# EAGLE design ai_candle (EAGLE 7.1.0)
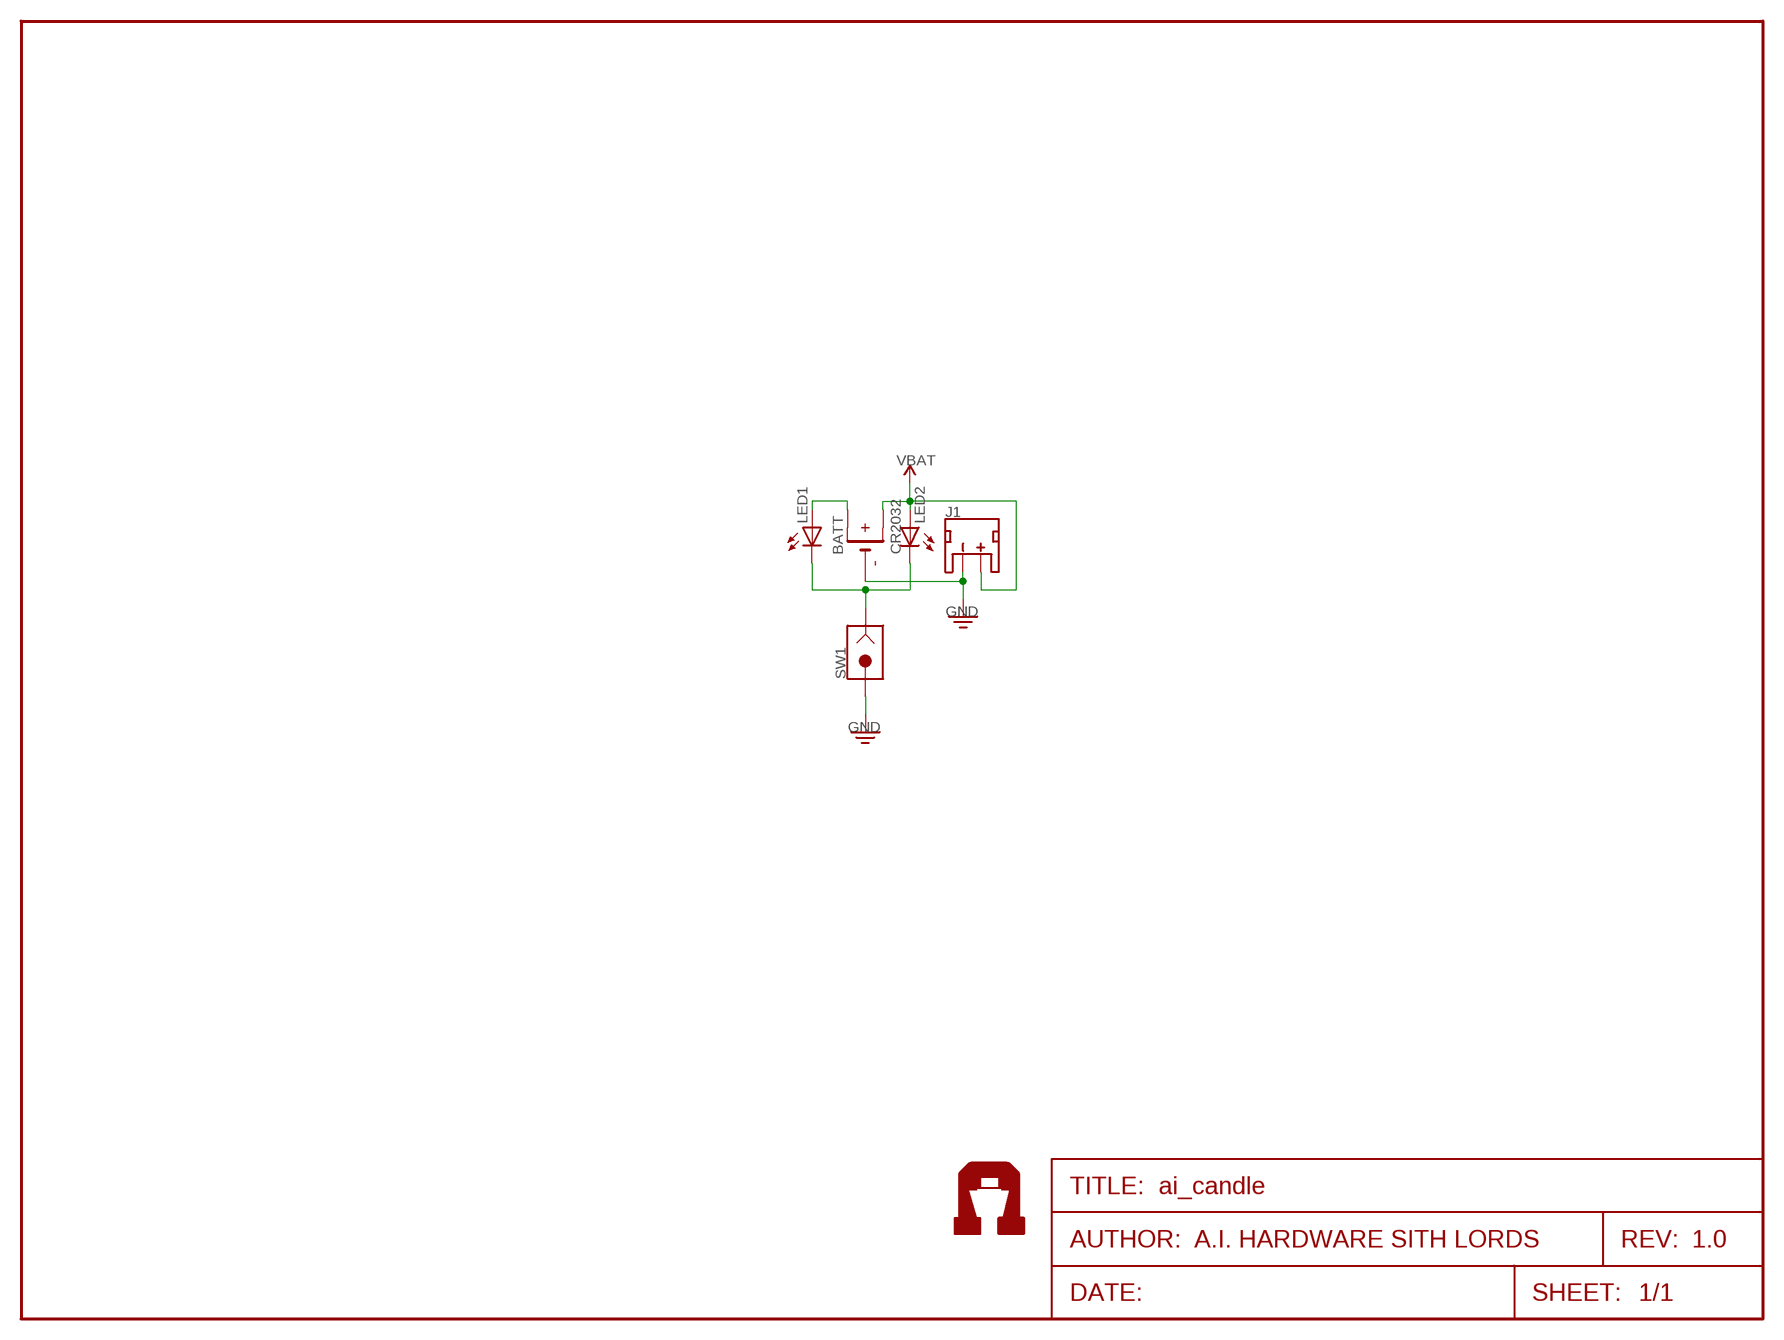
[diagram p0: schematic, sheet 1]
FRAME1 (FRAME-LETTER): AUTHOR: A.I. HARDWARE SITH LORDS; REV: 1.0

## Parts
BATT  CR2032  [CR2032-TH]
J1  JST-2-MALE  [JST-2P-SMD]
LED1  LED5MM  [LED-5MM]
LED2  LED5MM  [LED-5MM]
SW1  TILT-SW-200D  [TILT]
U$2  AI-LOGOM  [AI-LOGO-M]

## Nets
GND: BATT.3(-) J1.2(-) SW1.2
N$1: BATT.1(+) LED1.A
N$2: LED1.C LED2.C SW1.1
VBAT: BATT.2(+) J1.1(+) LED2.A

## Library data of the parts
BATT = Ai_Connectors:CR2032
J1 = Ai_Connectors:JST-2-MALE
LED1 LED2 = Ai_LED:LED
SW1 = Ai_Sensors:TILT
U$2 = Ai_Miscellany:AI-LOGO

## Board
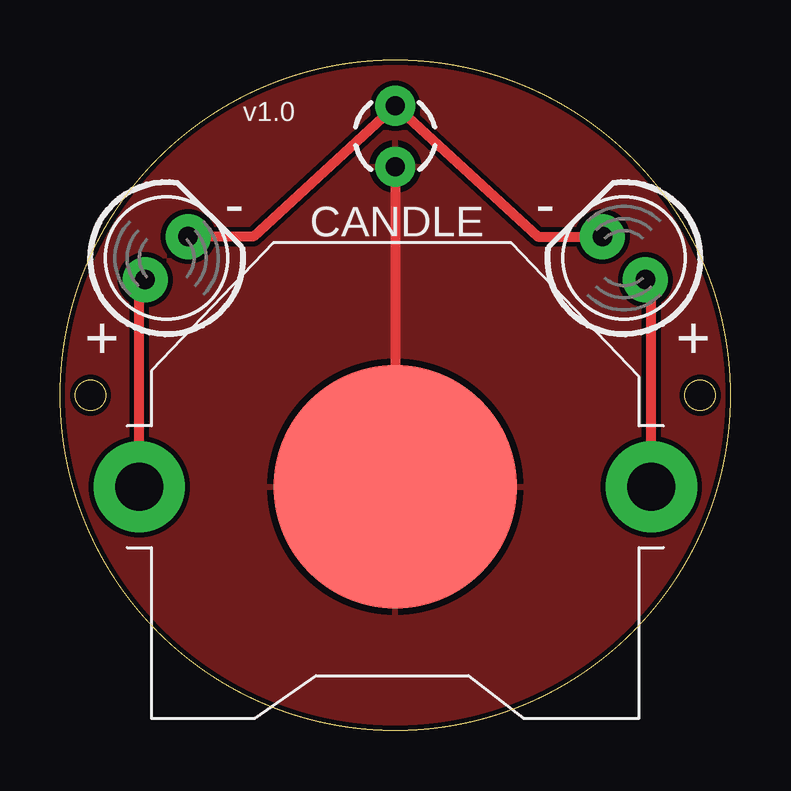
[diagram p1: board, top side]
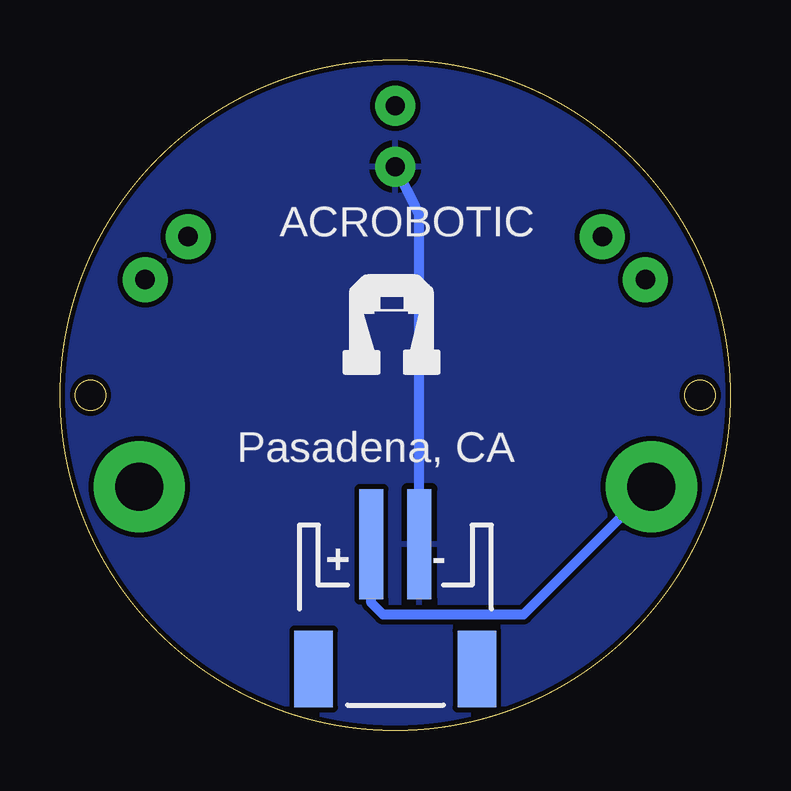
[diagram p2: board, bottom side, seen from below]

Size 27.94 x 27.94 mm. Coordinates in mm from the lower left corner, seen from the top.
Outline: circle at 13.97,13.97 radius 13.97
Outline: circle at 1.27,13.97 radius 0.64
Outline: circle at 26.67,13.97 radius 0.64
Copper layers (1*16): Top 0.035mm / dielectric 1.5mm / Bottom 0.035mm
Design rules "ai_2layer": minimum track width 7mil, minimum drill 15mil, track to track 8mil, track to pad 8mil, pad to pad 8mil, via to via 8mil, smd to smd 8mil, copper to edge 8mil, drill to drill 8mil, minimum pad ring 12mil, minimum via ring 10mil, stop-mask expansion 4mil, vias tented up to drill 20mil, thermal gap 10mil

### Footprints (pad centres in the part's own frame; a part is rotated, then mirrored left to right if it is on the bottom)
CR2032-TH = drill 2 pad 3.81: 1 -10.668,0; 2 10.668,0 | smd 10.16 x 10.16: 3 0,0
JST-2P-SMD = smd 1 x 4.6: 1 1,-3.7; 2 -1,-3.7 | smd 1.6 x 3.2: NC1 -3.4,1.5; NC2 3.4,1.5
LED-5MM = drill 0.813 pad 1.88: A -1.27,0; C 1.27,0
TILT = drill 0.8 pad 1.676: 1 -1.27,0; 2 1.27,0

### Placement (x,y rotation side)
BATT  13.97,10.16 180 top
J1  13.97,4.06 180 bottom
LED1  23.5,19.68 135 top
LED2  4.45,19.68 45 top
SW1  13.97,24.77 270 top
U$2  16.26,14.73 0 bottom

### Tracks (layer width: path | path; a pad name or v marks a point on that pad's centre or on a via)
GND
  Top 0.406: SW1.2 BATT.3
  Bottom 0.406: J1.2 12.97,21.51 SW1.2
  pour Bottom: 0,0 27.94,0 27.94,27.94 0,27.94
  pour Top: 0,0 27.94,0 27.94,27.94 0,27.94
N$1
  Top 0.406: BATT.1 24.64,18.54 LED1.A
N$2
  Top 0.406: LED1.C 19.9,20.58 SW1.1 8.04,20.58 LED2.C
VBAT
  Top 0.406: BATT.2 3.3,18.54 LED2.A
  Bottom 0.406: BATT.2 8.64,4.83 14.48,4.83 14.97,5.32 J1.1

### Text on the board
tPlace: v1.0 | - | CANDLE | - | + | +
bPlace: ACROBOTIC | Pasadena, CA